# Altium schematic sheet summary.SchDoc
size A3; Hw_rev: R1; Address3: Firenze; Address4: ITALY; Revision: 0; SheetNumber: 1; SheetTotal: 1
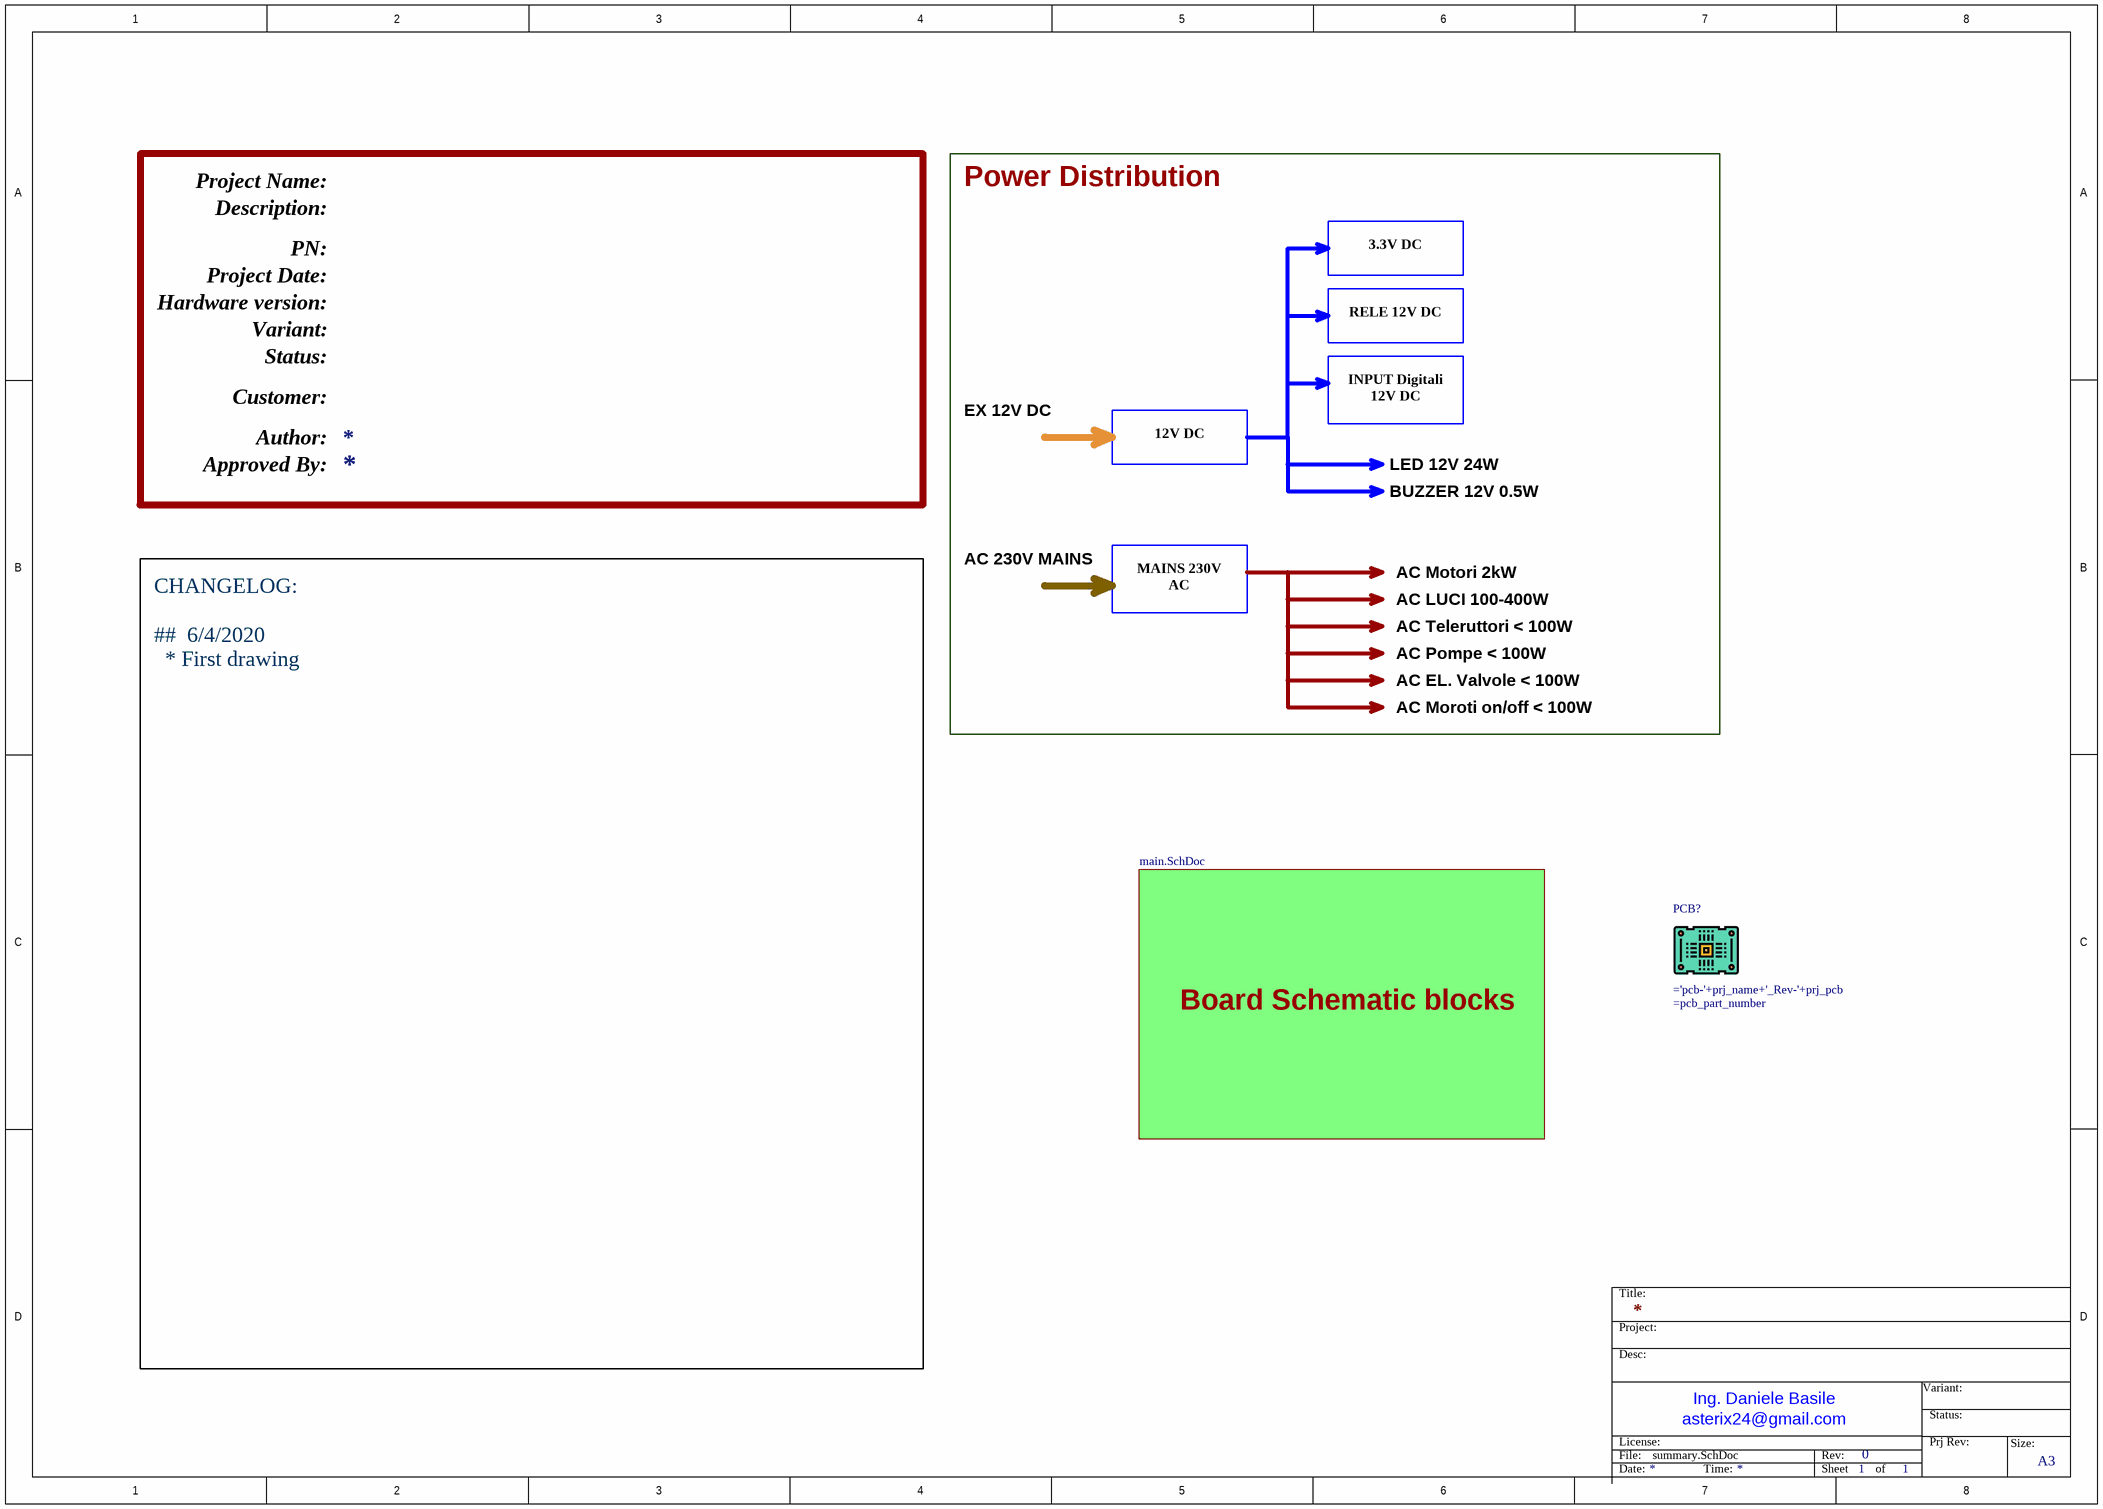
[diagram p0: summary.SchDoc]

## Parts
PCB?  (no value)  (mechanical)

## Sub-sheets
? = main.SchDoc: no entries

## Notes on the sheet
- Project Name:
- Description:
- PN:
- Power Distribution
- Hardware version:
- Project Date:
- 3.3V DC
- Variant:
- Status:
- RELE 12V DC
- Author:
- Customer:
- EX 12V DC
- INPUT Digitali 12V DC
- Approved By:
- 12V DC
- LED 12V 24W
- BUZZER 12V 0.5W
- AC 230V MAINS
- AC Motori 2kW
- MAINS 230V AC
- AC LUCI 100-400W
- AC Teleruttori < 100W
- AC Pompe < 100W
- AC EL. Valvole < 100W
- AC Moroti on/off < 100W
- Board Schematic blocks
- CHANGELOG:
  ##  6/4/2020
  * First drawing
- Title:
- Project:
- Desc:
- File:
- License:
- asterix24@gmail.com
- Ing. Daniele Basile
- Rev:
- Prj Rev:
- Size:
- Date:
- Time:
- Sheet
- of
- A3

## Library data of the parts
PCB? = PCB: ='['+ pcb_part_number+'], ' + 'pcb-'+prj_name+'_Rev-'+prj_pcb + ', Betamotor'; Publisher: Develer srl; Revision: 0.1; NOTE Manufacturer PN: *; NOTE Manufacturer: *; MountTechnology: *; NOTE Description: *; NOTE Description 2: *; CODE Develer: =pcb_part_number